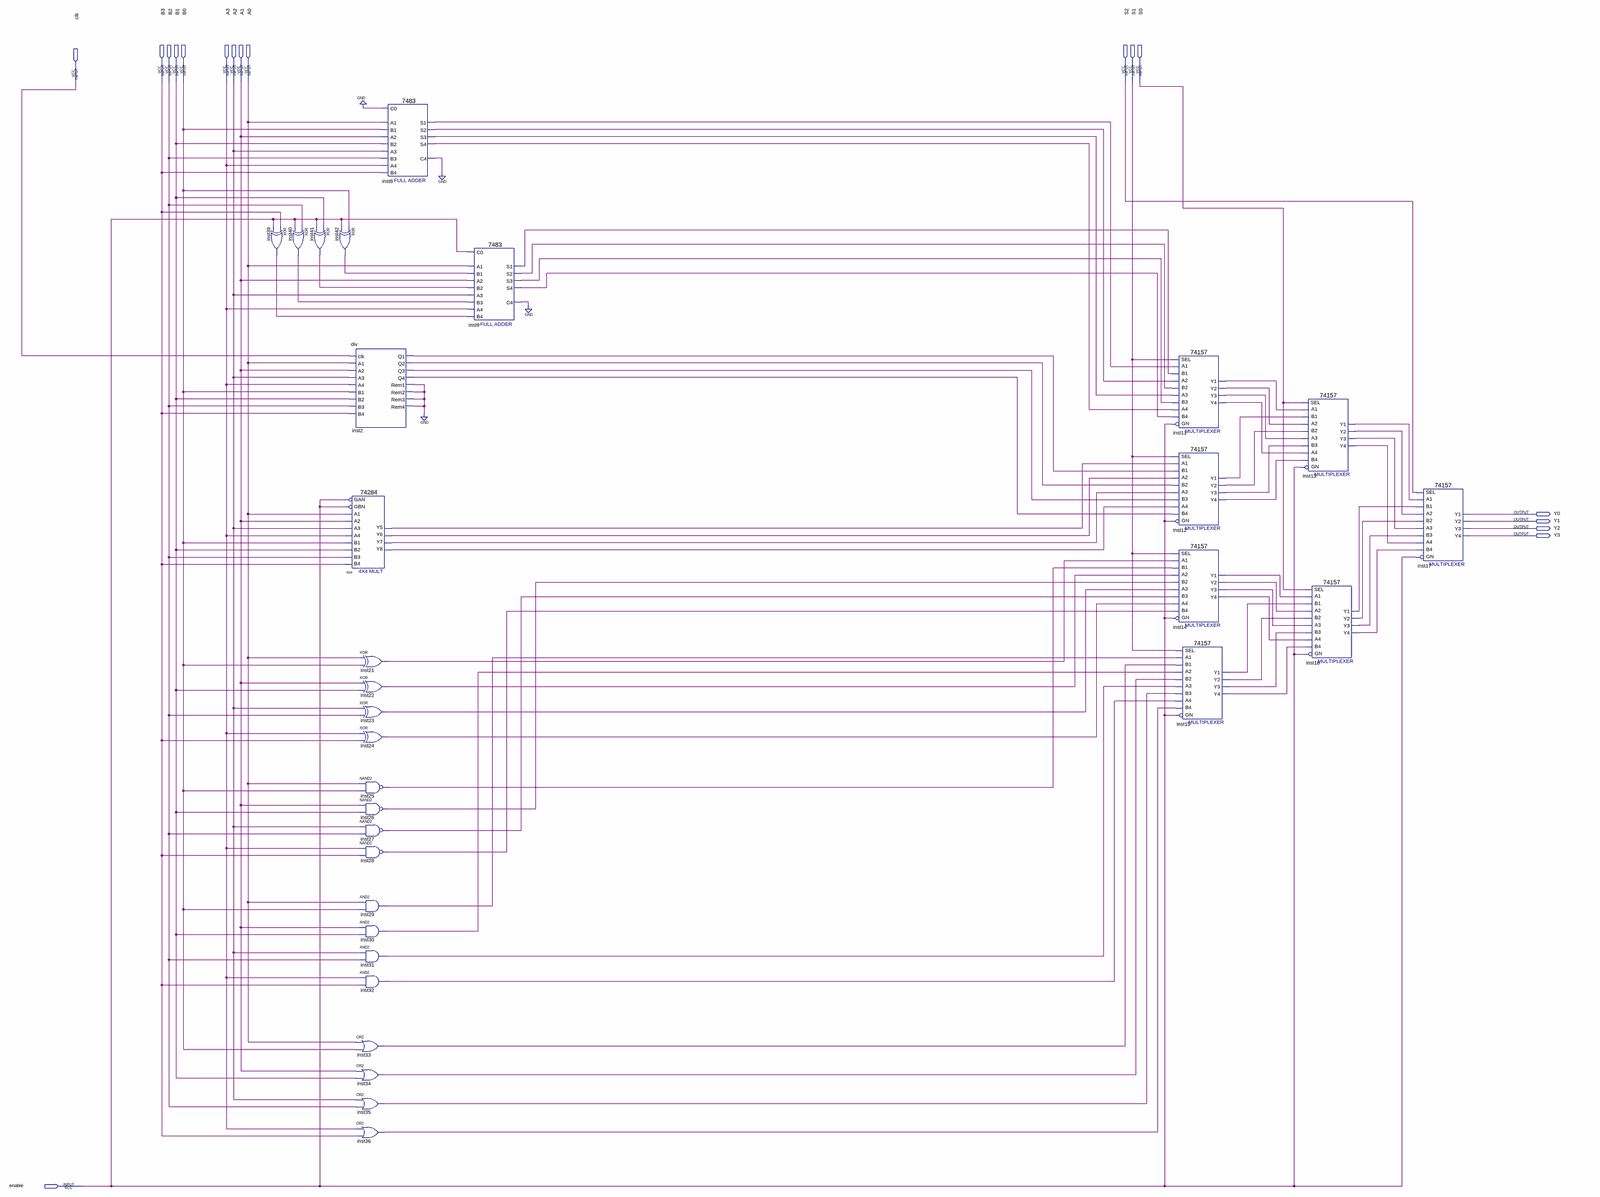
[diagram p0: schematic sheet, whole]
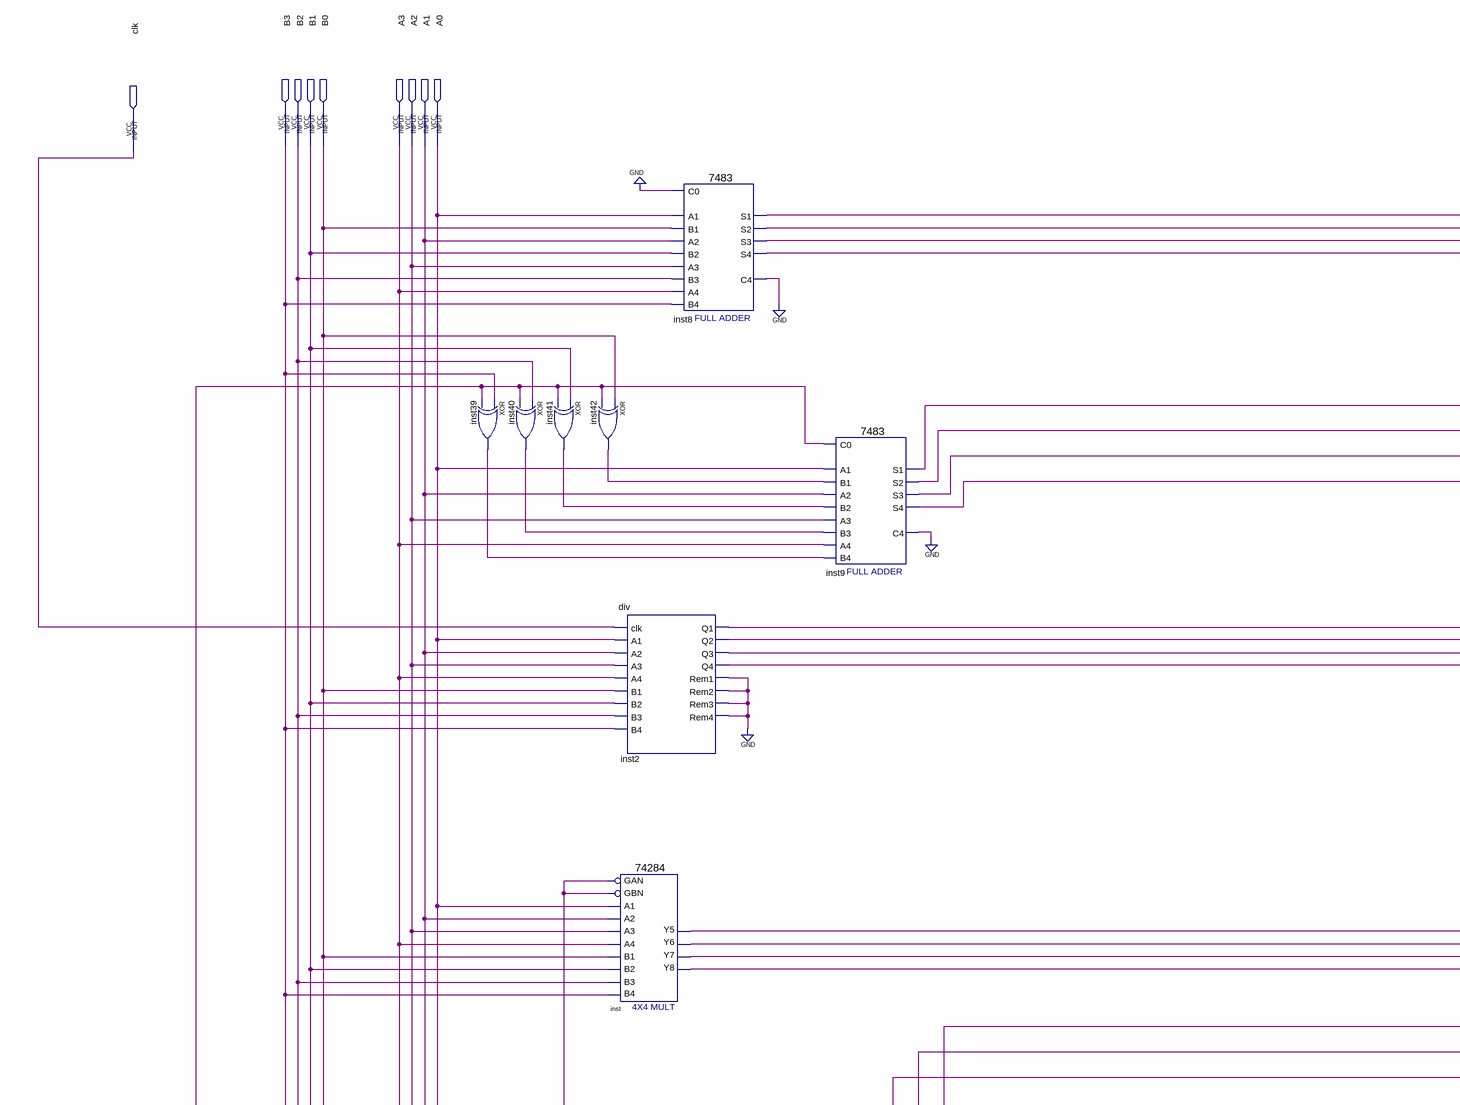
[diagram p1: schematic sheet, upper left part]
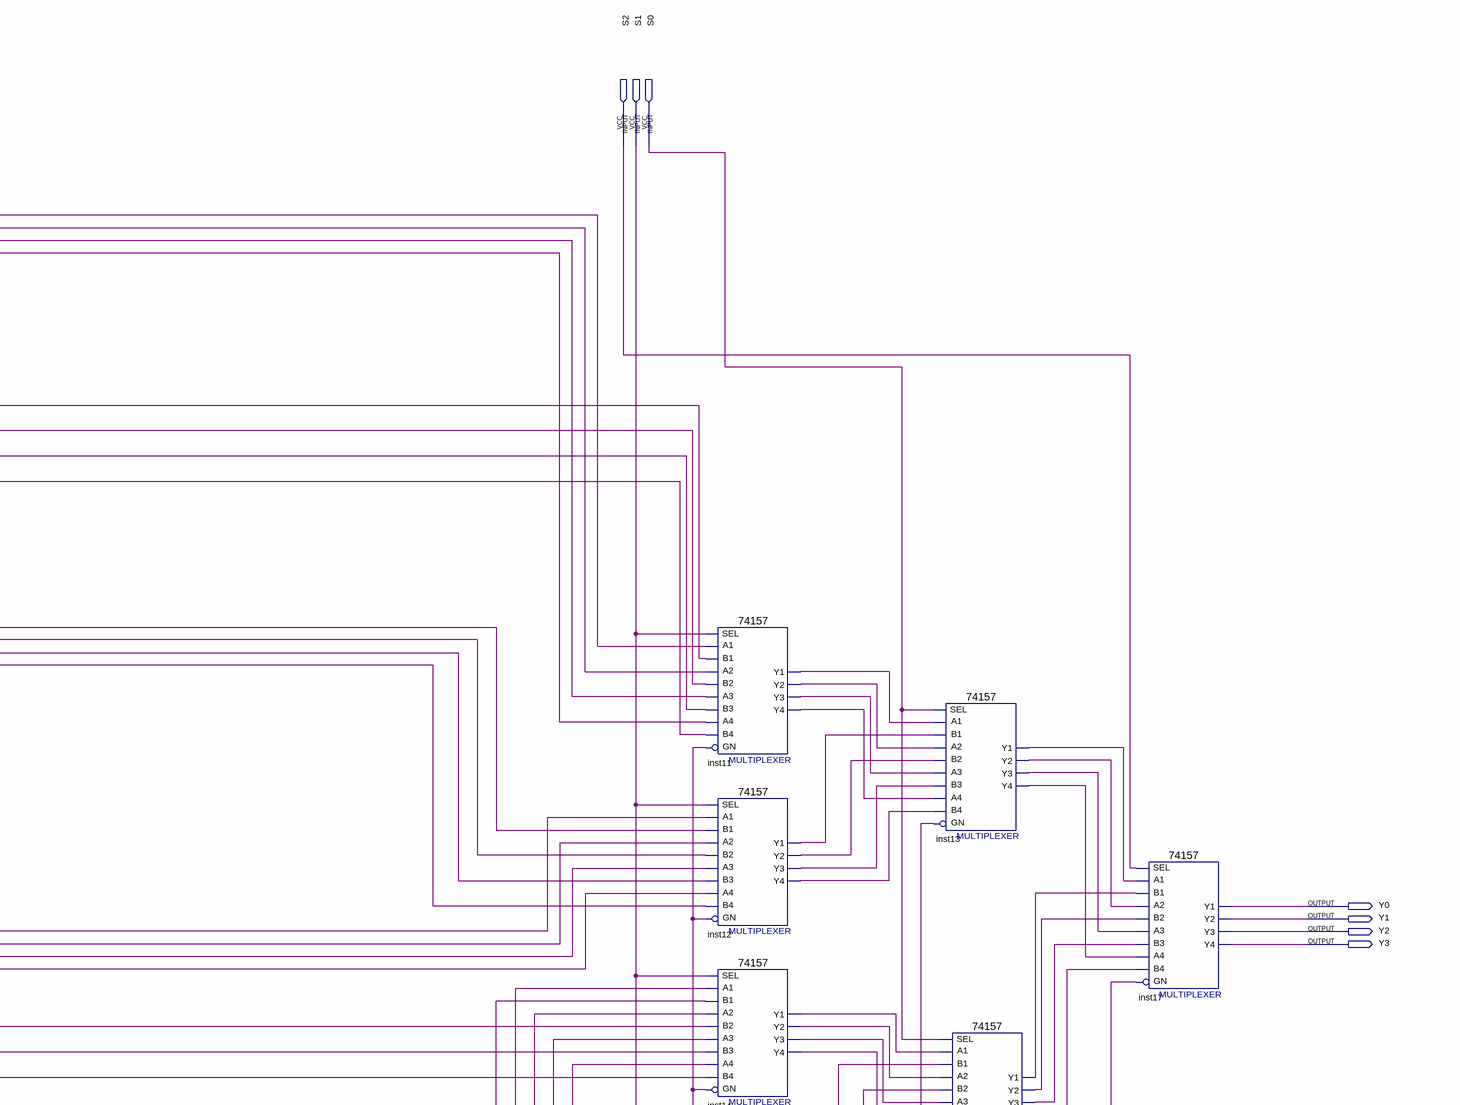
[diagram p2: schematic sheet, upper right part]
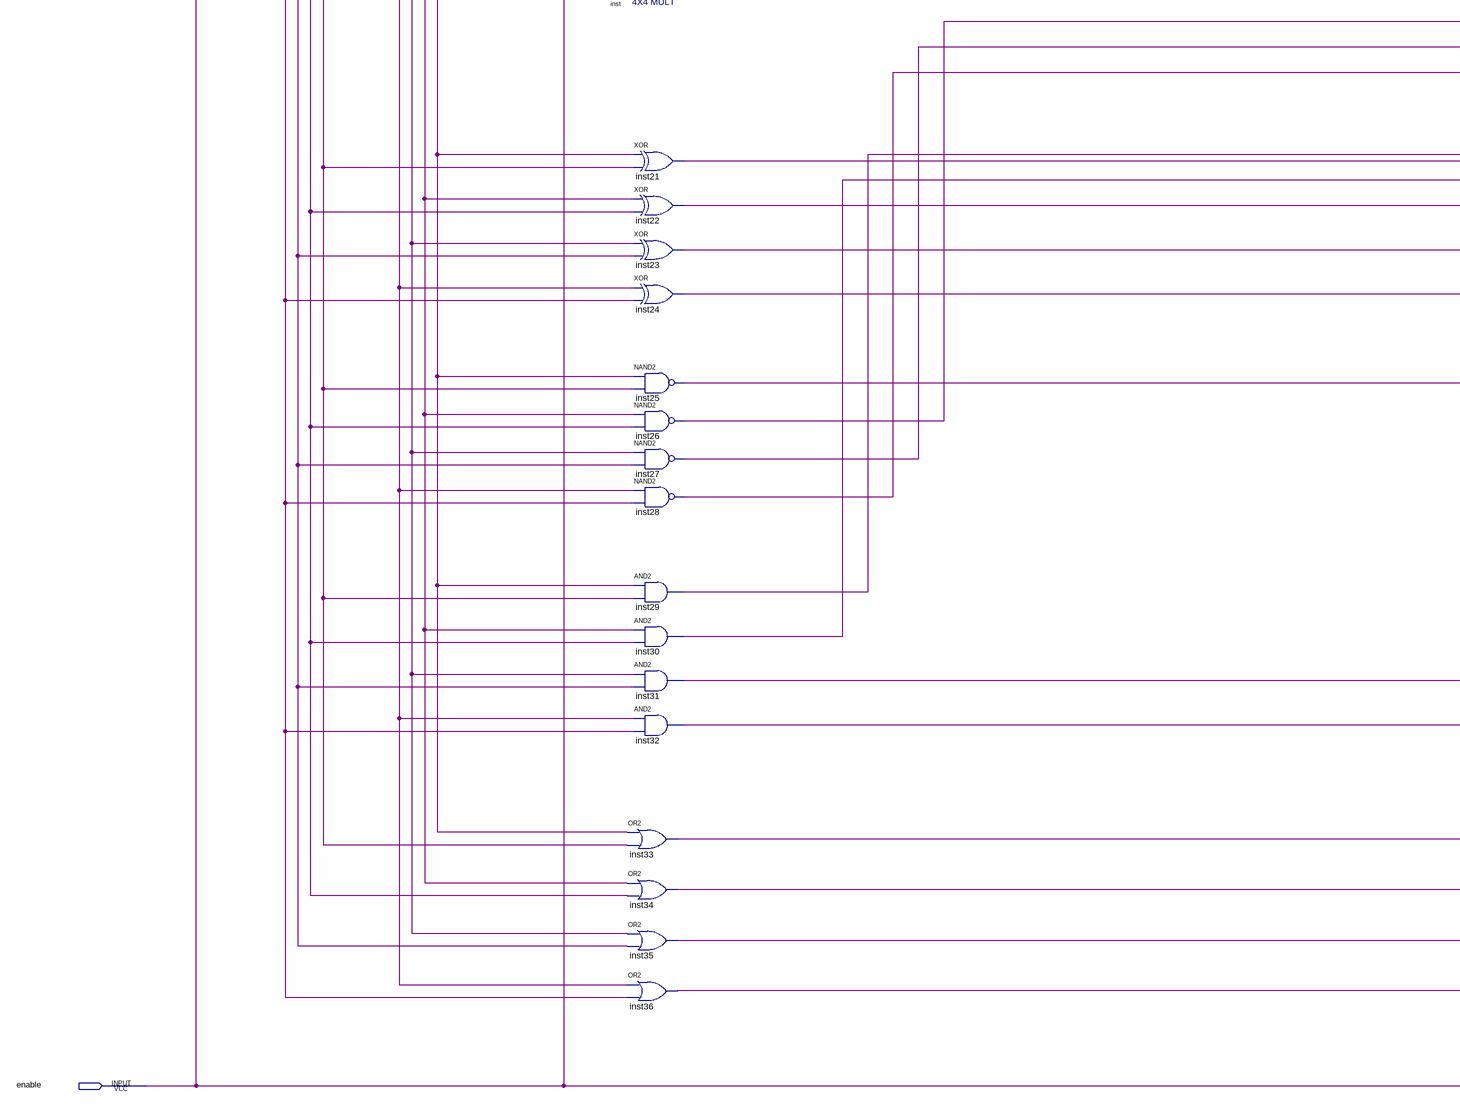
[diagram p3: schematic sheet, lower left part]
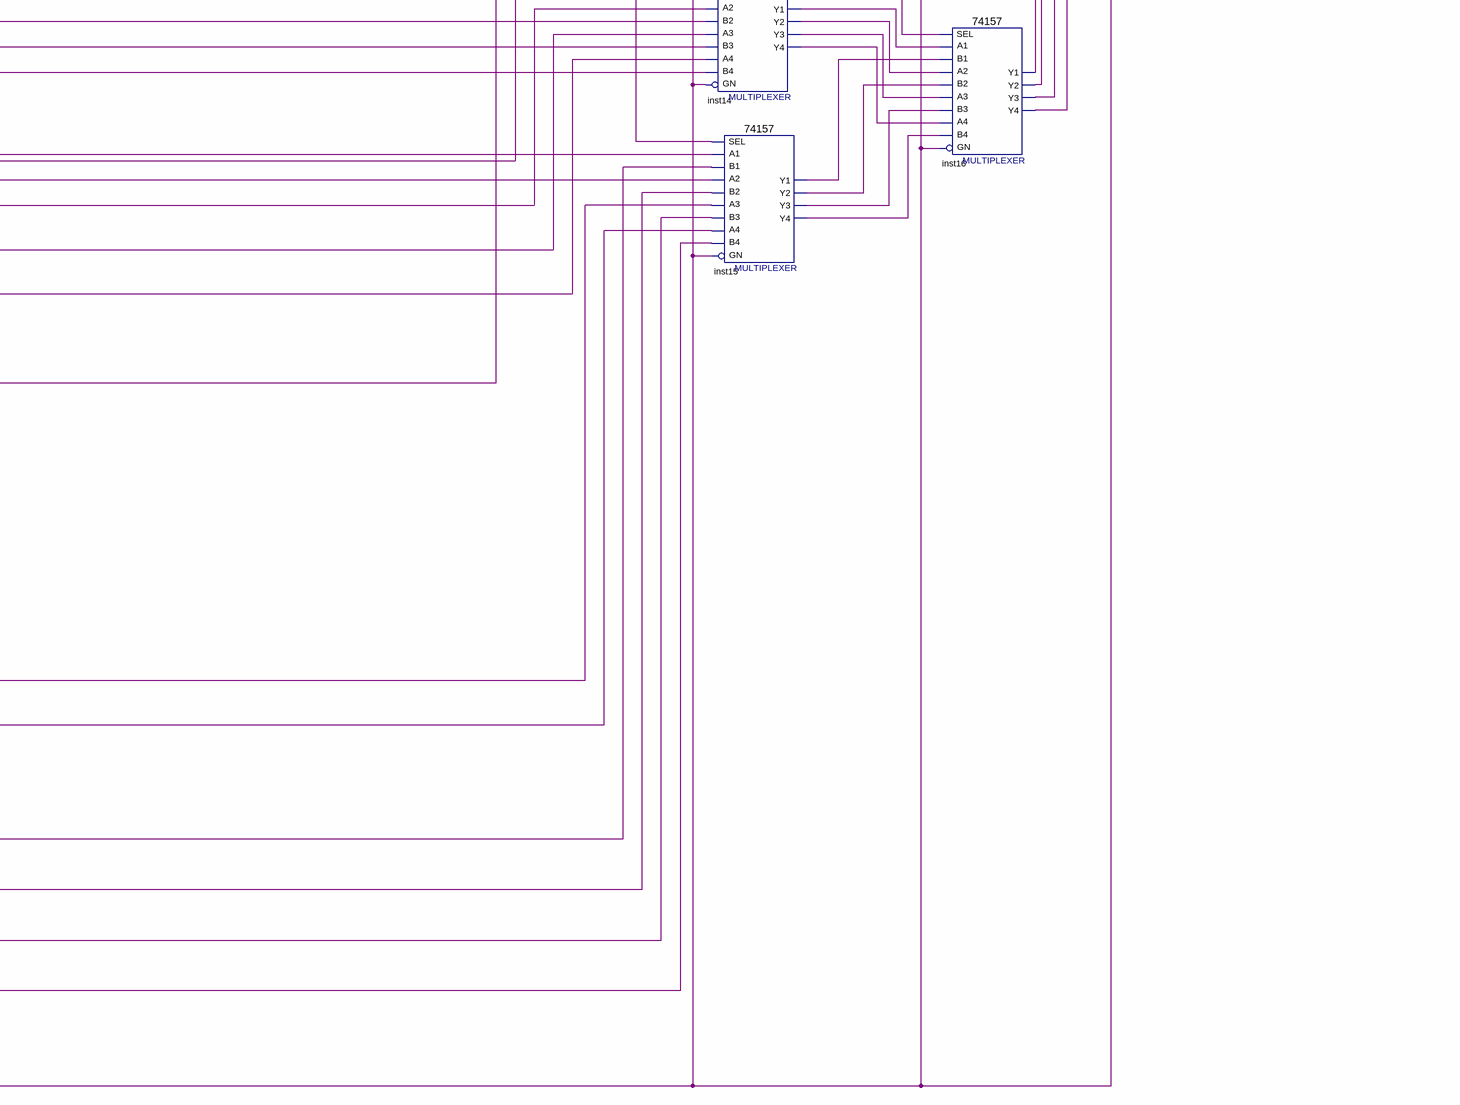
[diagram p4: schematic sheet, lower right part]
// Quartus schematic Calculator.bdf as structural Verilog: 31 symbols, 17 pins
module Calculator (
  input  B3,
  input  B2,
  input  B1,
  input  B0,
  input  A3,
  input  A2,
  input  A1,
  input  A0,
  input  S2,
  input  S1,
  input  S0,
  input  clk,
  input  enable,
  output Y0,
  output Y1,
  output Y2,
  output Y3
);

  wire inst2_q1, inst2_q2, inst2_q3, inst2_q4, inst2_rem1, inst8_c4, inst8_s1, inst8_s2, inst8_s3, inst8_s4,
       inst9_c4, inst9_s1, inst9_s2, inst9_s3, inst9_s4, inst11_y1, inst11_y2, inst11_y3, inst11_y4,
       inst12_y1, inst12_y2, inst12_y3, inst12_y4, inst13_y1, inst13_y2, inst13_y3, inst13_y4, inst14_y1,
       inst14_y2, inst14_y3, inst14_y4, inst15_y1, inst15_y2, inst15_y3, inst15_y4, inst16_y1, inst16_y2,
       inst16_y3, inst16_y4, inst21_out, inst22_out, inst23_out, inst24_out, inst25_out, inst26_out,
       inst27_out, inst28_out, inst29_out, inst30_out, inst31_out, inst32_out, inst33_out, inst34_out,
       inst35_out, inst36_out, inst39_out, inst40_out, inst41_out, inst42_out, inst_y5, inst_y6, inst_y7,
       inst_y8;

  xor inst39 (inst39_out, B3, enable);
  xor inst40 (inst40_out, B2, enable);
  xor inst41 (inst41_out, B1, enable);
  xor inst42 (inst42_out, B0, enable);
  div inst2 (
    .clk(clk), .A1(A0), .A2(A1), .A3(A2), .A4(A3), .B1(B0), .B2(B1), .B3(B2), .B4(B3), .Q1(inst2_q1),
    .Q2(inst2_q2), .Q3(inst2_q3), .Q4(inst2_q4), .Rem1(inst2_rem1), .Rem2(inst2_rem1), .Rem3(inst2_rem1),
    .Rem4(inst2_rem1));
  \74284  inst (
    .GAN(enable), .A2(A1), .A1(A0), .GBN(enable), .B1(B0), .A4(A3), .A3(A2), .B4(B3), .B3(B2), .B2(B1),
    .Y8(inst_y8), .Y6(inst_y6), .Y7(inst_y7), .Y5(inst_y5));
  xor inst21 (inst21_out, A0, B0);
  xor inst22 (inst22_out, A1, B1);
  xor inst23 (inst23_out, A2, B2);
  xor inst24 (inst24_out, A3, B3);
  nand inst25 (inst25_out, A0, B0);
  nand inst26 (inst26_out, A1, B1);
  nand inst27 (inst27_out, A2, B2);
  nand inst28 (inst28_out, A3, B3);
  and inst29 (inst29_out, A0, B0);
  and inst30 (inst30_out, A1, B1);
  and inst31 (inst31_out, A2, B2);
  and inst32 (inst32_out, A3, B3);
  or inst33 (inst33_out, A0, B0);
  or inst34 (inst34_out, A1, B1);
  or inst35 (inst35_out, A2, B2);
  or inst36 (inst36_out, A3, B3);
  \7483  inst8 (
    .B4(B3), .C0(1'b0), .A1(A0), .A2(A1), .B1(B0), .B2(B1), .A3(A2), .B3(B2), .A4(A3), .S3(inst8_s3),
    .S4(inst8_s4), .S2(inst8_s2), .C4(inst8_c4), .S1(inst8_s1));
  \7483  inst9 (
    .B4(inst39_out), .C0(enable), .A1(A0), .A2(A1), .B1(inst42_out), .B2(inst41_out), .A3(A2),
    .B3(inst40_out), .A4(A3), .S3(inst9_s3), .S4(inst9_s4), .S2(inst9_s2), .C4(inst9_c4), .S1(inst9_s1));
  \74157  inst11 (
    .A1(inst8_s1), .B1(inst9_s1), .SEL(S1), .B2(inst9_s2), .A3(inst8_s3), .B3(inst9_s3), .A2(inst8_s2),
    .B4(inst9_s4), .GN(enable), .A4(inst8_s4), .Y2(inst11_y2), .Y1(inst11_y1), .Y4(inst11_y4), .Y3(inst11_y3));
  \74157  inst12 (
    .A1(inst_y5), .B1(inst2_q1), .SEL(S1), .B2(inst2_q2), .A3(inst_y7), .B3(inst2_q3), .A2(inst_y6),
    .B4(inst2_q4), .GN(enable), .A4(inst_y8), .Y2(inst12_y2), .Y1(inst12_y1), .Y4(inst12_y4), .Y3(inst12_y3));
  \74157  inst14 (
    .A1(inst21_out), .B1(inst25_out), .SEL(S1), .B2(inst26_out), .A3(inst23_out), .B3(inst27_out),
    .A2(inst22_out), .B4(inst28_out), .GN(enable), .A4(inst24_out), .Y2(inst14_y2), .Y1(inst14_y1),
    .Y4(inst14_y4), .Y3(inst14_y3));
  \74157  inst15 (
    .A1(inst29_out), .B1(inst33_out), .SEL(S1), .B2(inst34_out), .A3(inst31_out), .B3(inst35_out),
    .A2(inst30_out), .B4(inst36_out), .GN(enable), .A4(inst32_out), .Y2(inst15_y2), .Y1(inst15_y1),
    .Y4(inst15_y4), .Y3(inst15_y3));
  \74157  inst13 (
    .A1(inst11_y1), .B1(inst12_y1), .SEL(S0), .B2(inst12_y2), .A3(inst11_y3), .B3(inst12_y3), .A2(inst11_y2),
    .B4(inst12_y4), .GN(enable), .A4(inst11_y4), .Y2(inst13_y2), .Y1(inst13_y1), .Y4(inst13_y4),
    .Y3(inst13_y3));
  \74157  inst16 (
    .A1(inst14_y1), .B1(inst15_y1), .SEL(S0), .B2(inst15_y2), .A3(inst14_y3), .B3(inst15_y3), .A2(inst14_y2),
    .B4(inst15_y4), .GN(enable), .A4(inst14_y4), .Y2(inst16_y2), .Y1(inst16_y1), .Y4(inst16_y4),
    .Y3(inst16_y3));
  \74157  inst17 (
    .A1(inst13_y1), .B1(inst16_y1), .SEL(S2), .B2(inst16_y2), .A3(inst13_y3), .B3(inst16_y3), .A2(inst13_y2),
    .B4(inst16_y4), .GN(enable), .A4(inst13_y4), .Y2(Y1), .Y1(Y0), .Y4(Y3), .Y3(Y2));
  // also tied to GND on the sheet: {inst8_c4, inst9_c4, inst2_rem1}
endmodule
